# Altium schematic sheet imx6_power.SchDoc
size A3; SheetNumber: 6; SheetTotal: 21
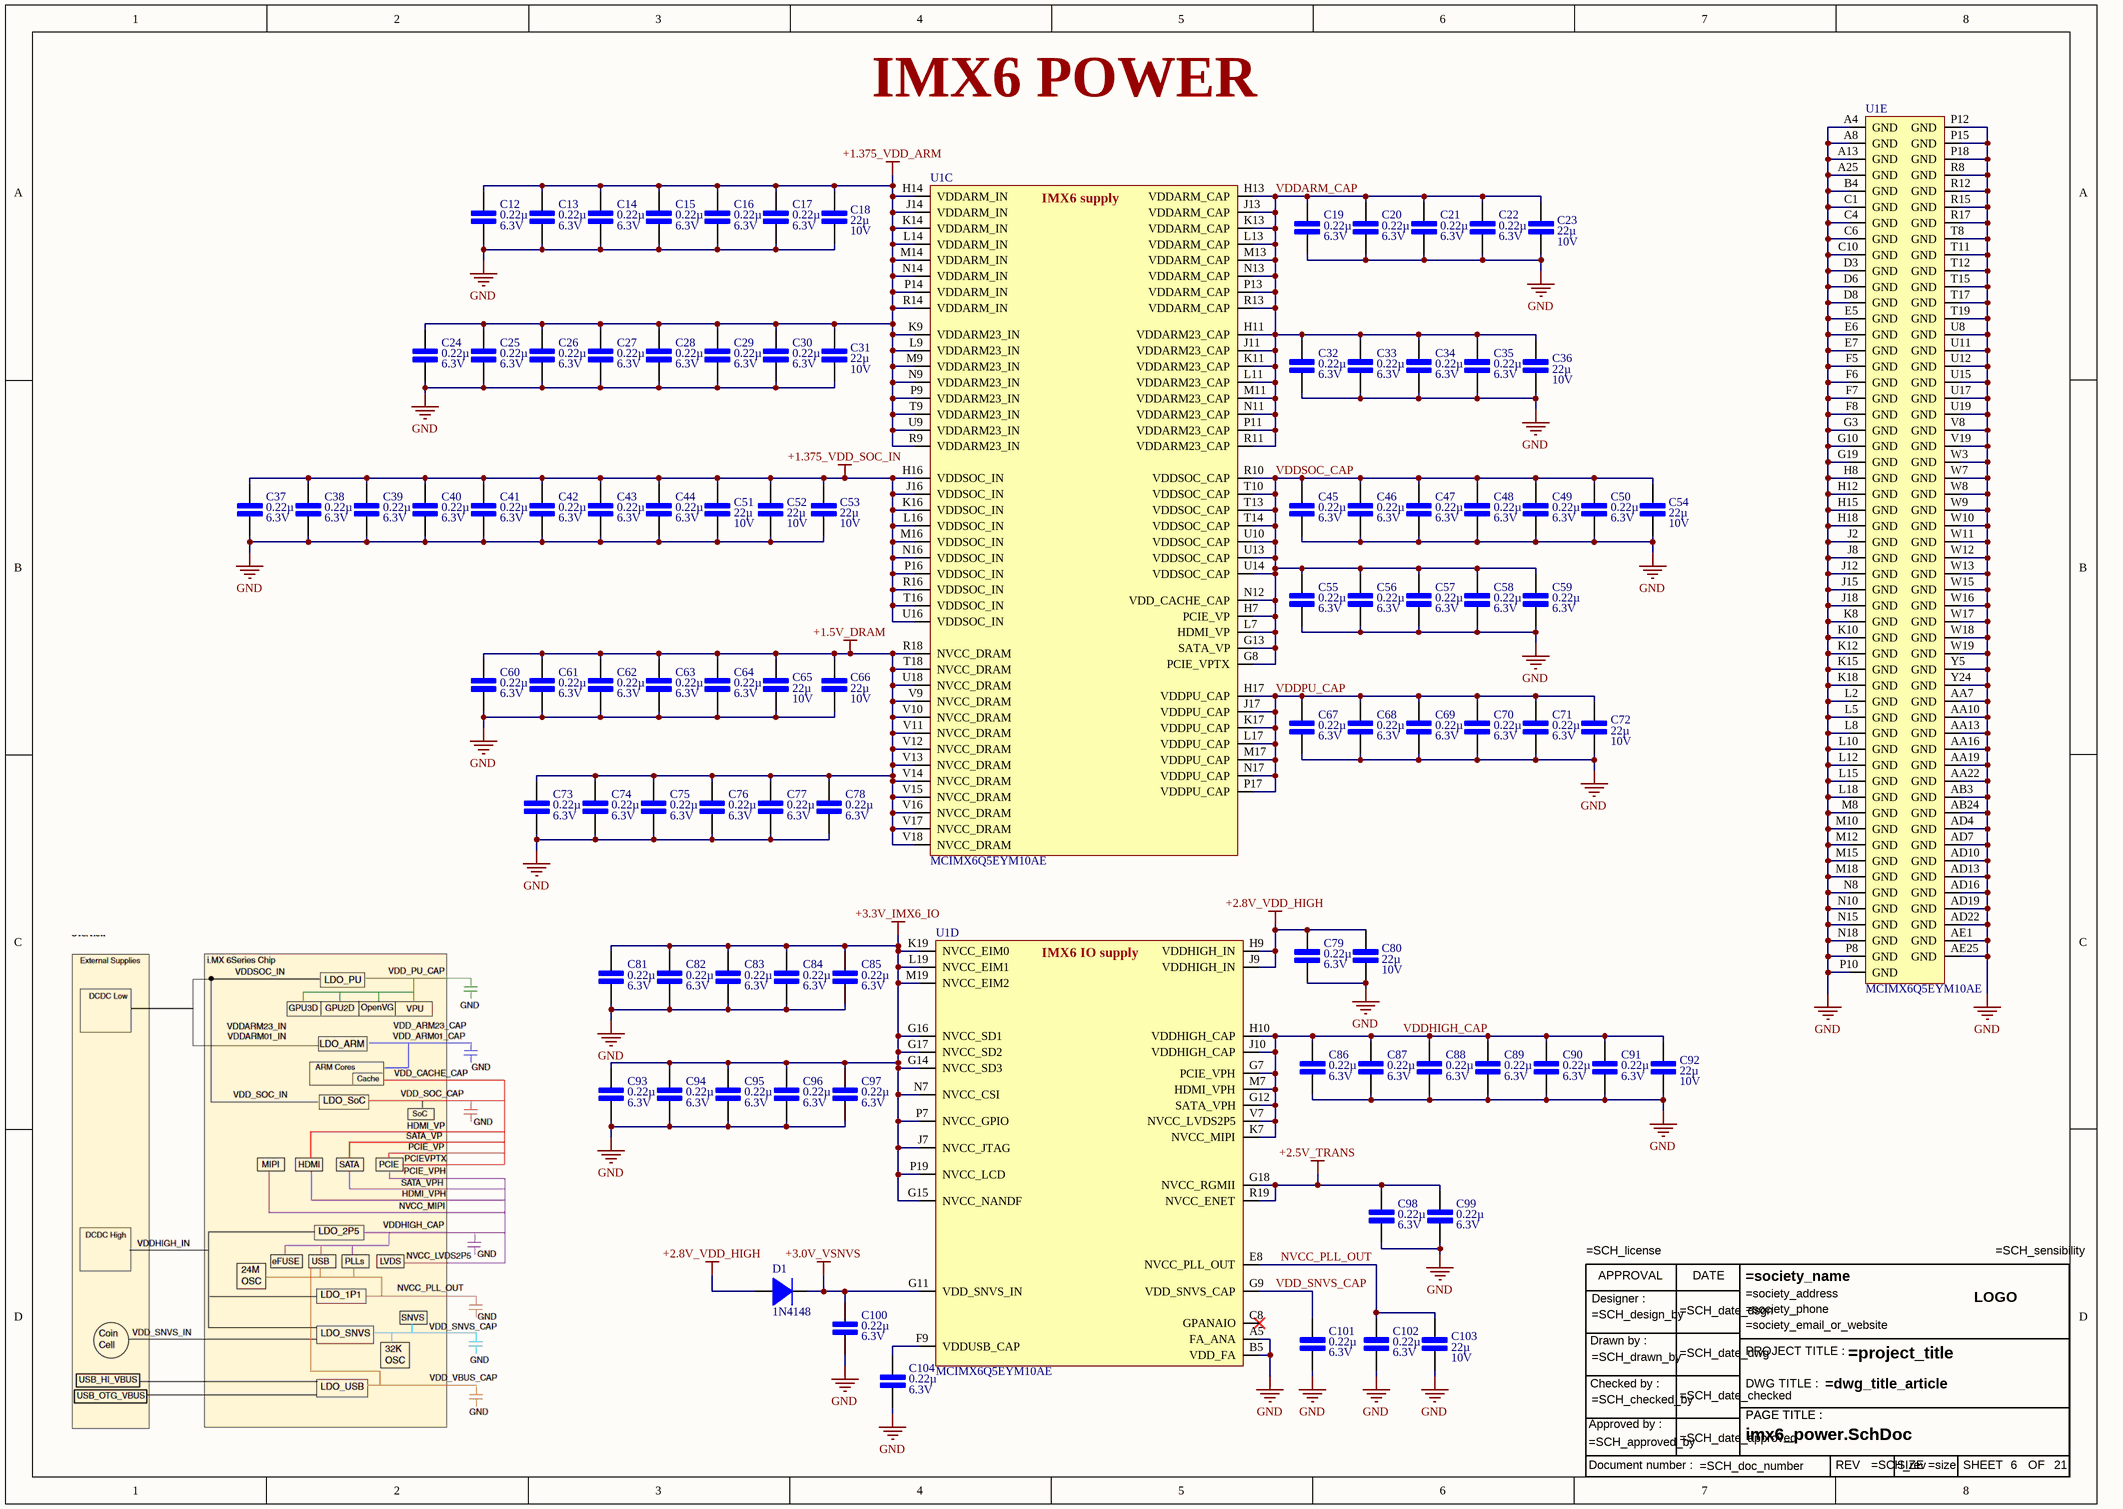
[diagram p0: imx6_power.SchDoc]

## Parts
C12  0.22µ  Tension du diélectrique: 6.3V  [CAP CER 0201/0603]
C13  0.22µ  Tension du diélectrique: 6.3V  [CAP CER 0201/0603]
C14  0.22µ  Tension du diélectrique: 6.3V  [CAP CER 0201/0603]
C15  0.22µ  Tension du diélectrique: 6.3V  [CAP CER 0201/0603]
C16  0.22µ  Tension du diélectrique: 6.3V  [CAP CER 0201/0603]
C17  0.22µ  Tension du diélectrique: 6.3V  [CAP CER 0201/0603]
C18  22µ  Tension du diélectrique: 10V  [Cap cer 0603/4608]
C19  0.22µ  Tension du diélectrique: 6.3V  [CAP CER 0201/0603]
C20  0.22µ  Tension du diélectrique: 6.3V  [CAP CER 0201/0603]
C21  0.22µ  Tension du diélectrique: 6.3V  [CAP CER 0201/0603]
C22  0.22µ  Tension du diélectrique: 6.3V  [CAP CER 0201/0603]
C23  22µ  Tension du diélectrique: 10V  [Cap cer 0603/4608]
C24  0.22µ  Tension du diélectrique: 6.3V  [CAP CER 0201/0603]
C25  0.22µ  Tension du diélectrique: 6.3V  [CAP CER 0201/0603]
C26  0.22µ  Tension du diélectrique: 6.3V  [CAP CER 0201/0603]
C27  0.22µ  Tension du diélectrique: 6.3V  [CAP CER 0201/0603]
C28  0.22µ  Tension du diélectrique: 6.3V  [CAP CER 0201/0603]
C29  0.22µ  Tension du diélectrique: 6.3V  [CAP CER 0201/0603]
C30  0.22µ  Tension du diélectrique: 6.3V  [CAP CER 0201/0603]
C31  22µ  Tension du diélectrique: 10V  [Cap cer 0603/4608]
C32  0.22µ  Tension du diélectrique: 6.3V  [CAP CER 0201/0603]
C33  0.22µ  Tension du diélectrique: 6.3V  [CAP CER 0201/0603]
C34  0.22µ  Tension du diélectrique: 6.3V  [CAP CER 0201/0603]
C35  0.22µ  Tension du diélectrique: 6.3V  [CAP CER 0201/0603]
C36  22µ  Tension du diélectrique: 10V  [Cap cer 0603/4608]
C37  0.22µ  Tension du diélectrique: 6.3V  [CAP CER 0201/0603]
C38  0.22µ  Tension du diélectrique: 6.3V  [CAP CER 0201/0603]
C39  0.22µ  Tension du diélectrique: 6.3V  [CAP CER 0201/0603]
C40  0.22µ  Tension du diélectrique: 6.3V  [CAP CER 0201/0603]
C41  0.22µ  Tension du diélectrique: 6.3V  [CAP CER 0201/0603]
C42  0.22µ  Tension du diélectrique: 6.3V  [CAP CER 0201/0603]
C43  0.22µ  Tension du diélectrique: 6.3V  [CAP CER 0201/0603]
C44  0.22µ  Tension du diélectrique: 6.3V  [CAP CER 0201/0603]
C45  0.22µ  Tension du diélectrique: 6.3V  [CAP CER 0201/0603]
C46  0.22µ  Tension du diélectrique: 6.3V  [CAP CER 0201/0603]
C47  0.22µ  Tension du diélectrique: 6.3V  [CAP CER 0201/0603]
C48  0.22µ  Tension du diélectrique: 6.3V  [CAP CER 0201/0603]
C49  0.22µ  Tension du diélectrique: 6.3V  [CAP CER 0201/0603]
C50  0.22µ  Tension du diélectrique: 6.3V  [CAP CER 0201/0603]
C51  22µ  Tension du diélectrique: 10V  [Cap cer 0603/4608]
C52  22µ  Tension du diélectrique: 10V  [Cap cer 0603/4608]
C53  22µ  Tension du diélectrique: 10V  [Cap cer 0603/4608]
C54  22µ  Tension du diélectrique: 10V  [Cap cer 0603/4608]
C55  0.22µ  Tension du diélectrique: 6.3V  [CAP CER 0201/0603]
C56  0.22µ  Tension du diélectrique: 6.3V  [CAP CER 0201/0603]
C57  0.22µ  Tension du diélectrique: 6.3V  [CAP CER 0201/0603]
C58  0.22µ  Tension du diélectrique: 6.3V  [CAP CER 0201/0603]
C59  0.22µ  Tension du diélectrique: 6.3V  [CAP CER 0201/0603]
C60  0.22µ  Tension du diélectrique: 6.3V  [CAP CER 0201/0603]
C61  0.22µ  Tension du diélectrique: 6.3V  [CAP CER 0201/0603]
C62  0.22µ  Tension du diélectrique: 6.3V  [CAP CER 0201/0603]
C63  0.22µ  Tension du diélectrique: 6.3V  [CAP CER 0201/0603]
C64  0.22µ  Tension du diélectrique: 6.3V  [CAP CER 0201/0603]
C65  22µ  Tension du diélectrique: 10V  [Cap cer 0603/4608]
C66  22µ  Tension du diélectrique: 10V  [Cap cer 0603/4608]
C67  0.22µ  Tension du diélectrique: 6.3V  [CAP CER 0201/0603]
C68  0.22µ  Tension du diélectrique: 6.3V  [CAP CER 0201/0603]
C69  0.22µ  Tension du diélectrique: 6.3V  [CAP CER 0201/0603]
C70  0.22µ  Tension du diélectrique: 6.3V  [CAP CER 0201/0603]
C71  0.22µ  Tension du diélectrique: 6.3V  [CAP CER 0201/0603]
C72  22µ  Tension du diélectrique: 10V  [Cap cer 0603/4608]
C73  0.22µ  Tension du diélectrique: 6.3V  [CAP CER 0201/0603]
C74  0.22µ  Tension du diélectrique: 6.3V  [CAP CER 0201/0603]
C75  0.22µ  Tension du diélectrique: 6.3V  [CAP CER 0201/0603]
C76  0.22µ  Tension du diélectrique: 6.3V  [CAP CER 0201/0603]
C77  0.22µ  Tension du diélectrique: 6.3V  [CAP CER 0201/0603]
C78  0.22µ  Tension du diélectrique: 6.3V  [CAP CER 0201/0603]
C79  0.22µ  Tension du diélectrique: 6.3V  [CAP CER 0201/0603]
C80  22µ  Tension du diélectrique: 10V  [Cap cer 0603/4608]
C81  0.22µ  Tension du diélectrique: 6.3V  [CAP CER 0201/0603]
C82  0.22µ  Tension du diélectrique: 6.3V  [CAP CER 0201/0603]
C83  0.22µ  Tension du diélectrique: 6.3V  [CAP CER 0201/0603]
C84  0.22µ  Tension du diélectrique: 6.3V  [CAP CER 0201/0603]
C85  0.22µ  Tension du diélectrique: 6.3V  [CAP CER 0201/0603]
C86  0.22µ  Tension du diélectrique: 6.3V  [CAP CER 0201/0603]
C87  0.22µ  Tension du diélectrique: 6.3V  [CAP CER 0201/0603]
C88  0.22µ  Tension du diélectrique: 6.3V  [CAP CER 0201/0603]
C89  0.22µ  Tension du diélectrique: 6.3V  [CAP CER 0201/0603]
C90  0.22µ  Tension du diélectrique: 6.3V  [CAP CER 0201/0603]
C91  0.22µ  Tension du diélectrique: 6.3V  [CAP CER 0201/0603]
C92  22µ  Tension du diélectrique: 10V  [Cap cer 0603/4608]
C93  0.22µ  Tension du diélectrique: 6.3V  [CAP CER 0201/0603]
C94  0.22µ  Tension du diélectrique: 6.3V  [CAP CER 0201/0603]
C95  0.22µ  Tension du diélectrique: 6.3V  [CAP CER 0201/0603]
C96  0.22µ  Tension du diélectrique: 6.3V  [CAP CER 0201/0603]
C97  0.22µ  Tension du diélectrique: 6.3V  [CAP CER 0201/0603]
C98  0.22µ  Tension du diélectrique: 6.3V  [CAP CER 0201/0603]
C99  0.22µ  Tension du diélectrique: 6.3V  [CAP CER 0201/0603]
C100  0.22µ  Tension du diélectrique: 6.3V  [CAP CER 0201/0603]
C101  0.22µ  Tension du diélectrique: 6.3V  [CAP CER 0201/0603]
C102  0.22µ  Tension du diélectrique: 6.3V  [CAP CER 0201/0603]
C103  22µ  Tension du diélectrique: 10V  [Cap cer 0603/4608]
C104  0.22µ  Tension du diélectrique: 6.3V  [CAP CER 0201/0603]
D1  1N4148  [diode SOD-123]
TB4  Title bloc ANSI modified  (value not drawn)
U1  MCIMX6Q5EYM10AE  [FRES-2197-01]  (parts C,D,E of 21)

## Nets
+1.5V_DRAM: C60.1 C61.1 C62.1 C63.1 C64.1 C65.1 C66.1 C73.1 C74.1 C75.1 C76.1 C77.1 C78.1 U1.R18(NVCC_DRAM) U1.T18(NVCC_DRAM) U1.U18(NVCC_DRAM) U1.V9(NVCC_DRAM) U1.V10(NVCC_DRAM) U1.V11(NVCC_DRAM) U1.V12(NVCC_DRAM) U1.V13(NVCC_DRAM) U1.V14(NVCC_DRAM) U1.V15(NVCC_DRAM) U1.V16(NVCC_DRAM) U1.V17(NVCC_DRAM) U1.V18(NVCC_DRAM)
+1.375_VDD_ARM: C12.1 C13.1 C14.1 C15.1 C16.1 C17.1 C18.1 C24.1 C25.1 C26.1 C27.1 C28.1 C29.1 C30.1 C31.1 U1.H14(VDDARM_IN) U1.J14(VDDARM_IN) U1.K9(VDDARM23_IN) U1.K14(VDDARM_IN) U1.L9(VDDARM23_IN) U1.L14(VDDARM_IN) U1.M9(VDDARM23_IN) U1.M14(VDDARM_IN) U1.N9(VDDARM23_IN) U1.N14(VDDARM_IN) U1.P9(VDDARM23_IN) U1.P14(VDDARM_IN) U1.R9(VDDARM23_IN) U1.R14(VDDARM_IN) U1.T9(VDDARM23_IN) U1.U9(VDDARM23_IN)
+1.375_VDD_SOC_IN: C37.1 C38.1 C39.1 C40.1 C41.1 C42.1 C43.1 C44.1 C51.1 C52.1 C53.1 U1.H16(VDDSOC_IN) U1.J16(VDDSOC_IN) U1.K16(VDDSOC_IN) U1.L16(VDDSOC_IN) U1.M16(VDDSOC_IN) U1.N16(VDDSOC_IN) U1.P16(VDDSOC_IN) U1.R16(VDDSOC_IN) U1.T16(VDDSOC_IN) U1.U16(VDDSOC_IN)
+2.5V_TRANS: C98.1 C99.1 U1.G18(NVCC_RGMII) U1.R19(NVCC_ENET)
+2.8V_VDD_HIGH: C79.1 C80.1 D1.A U1.H9(VDDHIGH_IN) U1.J9(VDDHIGH_IN)
+3.0V_VSNVS: C100.1 D1.K U1.G11(VDD_SNVS_IN)
+3.3V_IMX6_IO: C81.1 C82.1 C83.1 C84.1 C85.1 C93.1 C94.1 C95.1 C96.1 C97.1 U1.G14(NVCC_SD3) U1.G15(NVCC_NANDF) U1.G16(NVCC_SD1) U1.G17(NVCC_SD2) U1.J7(NVCC_JTAG) U1.K19(NVCC_EIM0) U1.L19(NVCC_EIM1) U1.M19(NVCC_EIM2) U1.N7(NVCC_CSI) U1.P7(NVCC_GPIO) U1.P19(NVCC_LCD)
GND: C12.2 C13.2 C14.2 C15.2 C16.2 C17.2 C18.2 C19.2 C20.2 C21.2 C22.2 C23.2 C24.2 C25.2 C26.2 C27.2 C28.2 C29.2 C30.2 C31.2 C32.2 C33.2 C34.2 C35.2 C36.2 C37.2 C38.2 C39.2 C40.2 C41.2 C42.2 C43.2 C44.2 C45.2 C46.2 C47.2 C48.2 C49.2 C50.2 C51.2 C52.2 C53.2 C54.2 C55.2 C56.2 C57.2 C58.2 C59.2 C60.2 C61.2 C62.2 C63.2 C64.2 C65.2 C66.2 C67.2 C68.2 C69.2 C70.2 C71.2 C72.2 C73.2 C74.2 C75.2 C76.2 C77.2 C78.2 C79.2 C80.2 C81.2 C82.2 C83.2 C84.2 C85.2 C86.2 C87.2 C88.2 C89.2 C90.2 C91.2 C92.2 C93.2 C94.2 C95.2 C96.2 C97.2 C98.2 C99.2 C100.2 C101.2 C102.2 C103.2 C104.2 U1.A4(GND) U1.A5(FA_ANA) U1.A8(GND) U1.A13(GND) U1.A25(GND) U1.AA7(GND) U1.AA10(GND) U1.AA13(GND) U1.AA16(GND) U1.AA19(GND) U1.AA22(GND) U1.AB3(GND) U1.AB24(GND) U1.AD4(GND) U1.AD7(GND) U1.AD10(GND) U1.AD13(GND) U1.AD16(GND) U1.AD19(GND) U1.AD22(GND) U1.AE1(GND) U1.AE25(GND) U1.B4(GND) U1.B5(VDD_FA) U1.C1(GND) U1.C4(GND) U1.C6(GND) U1.C10(GND) U1.D3(GND) U1.D6(GND) U1.D8(GND) U1.E5(GND) U1.E6(GND) U1.E7(GND) U1.F5(GND) U1.F6(GND) U1.F7(GND) U1.F8(GND) U1.G3(GND) U1.G10(GND) U1.G19(GND) U1.H8(GND) U1.H12(GND) U1.H15(GND) U1.H18(GND) U1.J2(GND) U1.J8(GND) U1.J12(GND) U1.J15(GND) U1.J18(GND) U1.K8(GND) U1.K10(GND) U1.K12(GND) U1.K15(GND) U1.K18(GND) U1.L2(GND) U1.L5(GND) U1.L8(GND) U1.L10(GND) U1.L12(GND) U1.L15(GND) U1.L18(GND) U1.M8(GND) U1.M10(GND) U1.M12(GND) U1.M15(GND) U1.M18(GND) U1.N8(GND) U1.N10(GND) U1.N15(GND) U1.N18(GND) U1.P8(GND) U1.P10(GND) U1.P12(GND) U1.P15(GND) U1.P18(GND) U1.R8(GND) U1.R12(GND) U1.R15(GND) U1.R17(GND) U1.T8(GND) U1.T11(GND) U1.T12(GND) U1.T15(GND) U1.T17(GND) U1.T19(GND) U1.U8(GND) U1.U11(GND) U1.U12(GND) U1.U15(GND) U1.U17(GND) U1.U19(GND) U1.V8(GND) U1.V19(GND) U1.W3(GND) U1.W7(GND) U1.W8(GND) U1.W9(GND) U1.W10(GND) U1.W11(GND) U1.W12(GND) U1.W13(GND) U1.W15(GND) U1.W16(GND) U1.W17(GND) U1.W18(GND) U1.W19(GND) U1.Y5(GND) U1.Y24(GND)
NVCC_PLL_OUT: C102.1 C103.1 U1.E8(NVCC_PLL_OUT)
VDD_SNVS_CAP: C101.1 U1.G9(VDD_SNVS_CAP)
VDDARM_CAP: C19.1 C20.1 C21.1 C22.1 C23.1 C32.1 C33.1 C34.1 C35.1 C36.1 U1.H11(VDDARM23_CAP) U1.H13(VDDARM_CAP) U1.J11(VDDARM23_CAP) U1.J13(VDDARM_CAP) U1.K11(VDDARM23_CAP) U1.K13(VDDARM_CAP) U1.L11(VDDARM23_CAP) U1.L13(VDDARM_CAP) U1.M11(VDDARM23_CAP) U1.M13(VDDARM_CAP) U1.N11(VDDARM23_CAP) U1.N13(VDDARM_CAP) U1.P11(VDDARM23_CAP) U1.P13(VDDARM_CAP) U1.R11(VDDARM23_CAP) U1.R13(VDDARM_CAP)
VDDHIGH_CAP: C86.1 C87.1 C88.1 C89.1 C90.1 C91.1 C92.1 U1.G7(PCIE_VPH) U1.G12(SATA_VPH) U1.H10(VDDHIGH_CAP) U1.J10(VDDHIGH_CAP) U1.K7(NVCC_MIPI) U1.M7(HDMI_VPH) U1.V7(NVCC_LVDS2P5)
VDDPU_CAP: C67.1 C68.1 C69.1 C70.1 C71.1 C72.1 U1.H17(VDDPU_CAP) U1.J17(VDDPU_CAP) U1.K17(VDDPU_CAP) U1.L17(VDDPU_CAP) U1.M17(VDDPU_CAP) U1.N17(VDDPU_CAP) U1.P17(VDDPU_CAP)
VDDSOC_CAP: C45.1 C46.1 C47.1 C48.1 C49.1 C50.1 C54.1 C55.1 C56.1 C57.1 C58.1 C59.1 U1.G8(PCIE_VPTX) U1.G13(SATA_VP) U1.H7(PCIE_VP) U1.L7(HDMI_VP) U1.N12(VDD_CACHE_CAP) U1.R10(VDDSOC_CAP) U1.T10(VDDSOC_CAP) U1.T13(VDDSOC_CAP) U1.T14(VDDSOC_CAP) U1.U10(VDDSOC_CAP) U1.U13(VDDSOC_CAP) U1.U14(VDDSOC_CAP)
NetC104_1: C104.1 U1.F9(VDDUSB_CAP)

Not connected (* = marked no-connect by the designer): U1 C8(GPANAIO)*

## Notes on the sheet
- IMX6 POWER
- (in symbol IMX6Q5EYM10AE, part C) IMX6 supply
- (in symbol IMX6Q5EYM10AE, part D) IMX6 IO supply
- (in symbol Title bloc ANSI) APPROVAL; DATE; Designer :; LOGO; Drawn by :; PROJECT TITLE :; Checked by :; DWG TITLE :; PAGE TITLE :; Approved by :; Document number :; REV; SIZE; SHEET; OF

## Library data of the parts
C12-C17 C19-C22 C24-C30 C32-C35 C37-C50 C55-C64 C67-C71 C73-C79 C81-C91 C93-C102 C104 = cap 0.22µ 6.3V: cap solid electrolyte 0.22µ 6.3V 10%; Diélectrique: X5R
C18 C23 C31 C36 C51-C54 C65 C66 C72 C80 C92 C103 = cap 22µ 10V: cap cer 22µ 10V 10% X5R 0603; Diélectrique: X5R
D1 = Diode 1N4148 100V 150mA
TB4 = Title bloc ANSI
U1 = IMX6Q5EYM10AE: 32-Bit i.MX 6 Quad Application Processor, 1 GHz, 256 KB RAM, Extended Consumer Grade, 624-Pin FCPBGA, RoHS, Tape and Reel; PartNumber: MCIMX6Q5EYM10ACR; Manufacturer: Freescale Semiconductor; CAN: FlexCAN; Number of Cores: 4 Spec; External Memory Supported: DDR3, DDR3L, FLASH, LPDDR2; Speed Grade: 1 GHz; Core Type: ARM Cortex A9; Cache (KB): 32; Ethernet: 1 Gbps + IEEE 1588; Internal RAM (KB): 256; ComponentLink1Description: Manufacturer URL; ComponentLink2Description: Datasheet; DatasheetVersion: Rev. 2.3; ComponentLink3URL: http://cache.freescale.com/files/32bit/doc/data_sheet/IMX6DQCEC.pdf?fpsp=1&WT_TYPE=Data%20Sheets&WT_VENDOR=FREESCALE&WT_FILE_FORMAT=pdf&WT_ASSET=Documentation; ComponentLink1URL: http://www.freescale.com/; Packing: Tape and Reel; Temperature Range: -20 to 105 degC; ComponentLink2URL: http://cache.freescale.com/files/32bit/doc/data_sheet/IMX6DQCEC.pdf?fpsp=1&WT_TYPE=Data%20Sheets&WT_VENDOR=FREESCALE&WT_FILE_FORMAT=pdf&WT_ASSET=Documentation; ComponentLink3Description: Package Specification; PackageVersion: Rev. A; RoHS: TRUE; Quad/Dual CPU: i.MX 6Quad; Mounting Technology: Surface Mount; PackageReference: FCPBGA-624; PackageDescription: 624-pin Ball Grid Array Package, Body 21 x 21mm, Pitch 0.8mm